# Altium schematic sheet OMODRI_EtherCAT.SchDoc
size A3; Date: Not shown in title block; ApprovedBy: Not shown in title block; CheckedBy: Not shown in title block; Author: Not shown in title block; CompanyName: Not shown in title block; Engineer: Not shown in title block; Organization: Not shown in title block; Address1: Not shown in title block; Address2: Not shown in title block; Address3: Not shown in title block; Address4: Not shown in title block; DocumentNumber: 8; Revision: Use project parameter SCH_Rev; SheetNumber: 8; SheetTotal: 11; PageSetup: Record=PageOptions|CenterHorizontal=True|CenterVertical=True|PrintScale=1.00|XCorrection=1.00|YCorrection=1.00|PrintKind=0|BorderSize=5000000|LeftOffset=0|BottomOffset=0|Orientation=2|PaperLength=1000|PaperWidth=1000|Scale=100|PaperSource=15|PrintQuality=600|MediaType=1|DitherType=10|PaperKind=Letter|PrintScaleMode=1; CurrentTime: Not shown in title block; CurrentDate: Not shown in title block; Time: Not shown in title block; DocumentFullPathAndName: Not shown in title block; DocumentName: Not shown in title block; ModifiedDate: Not shown in title block; ImagePath: Not shown in title block
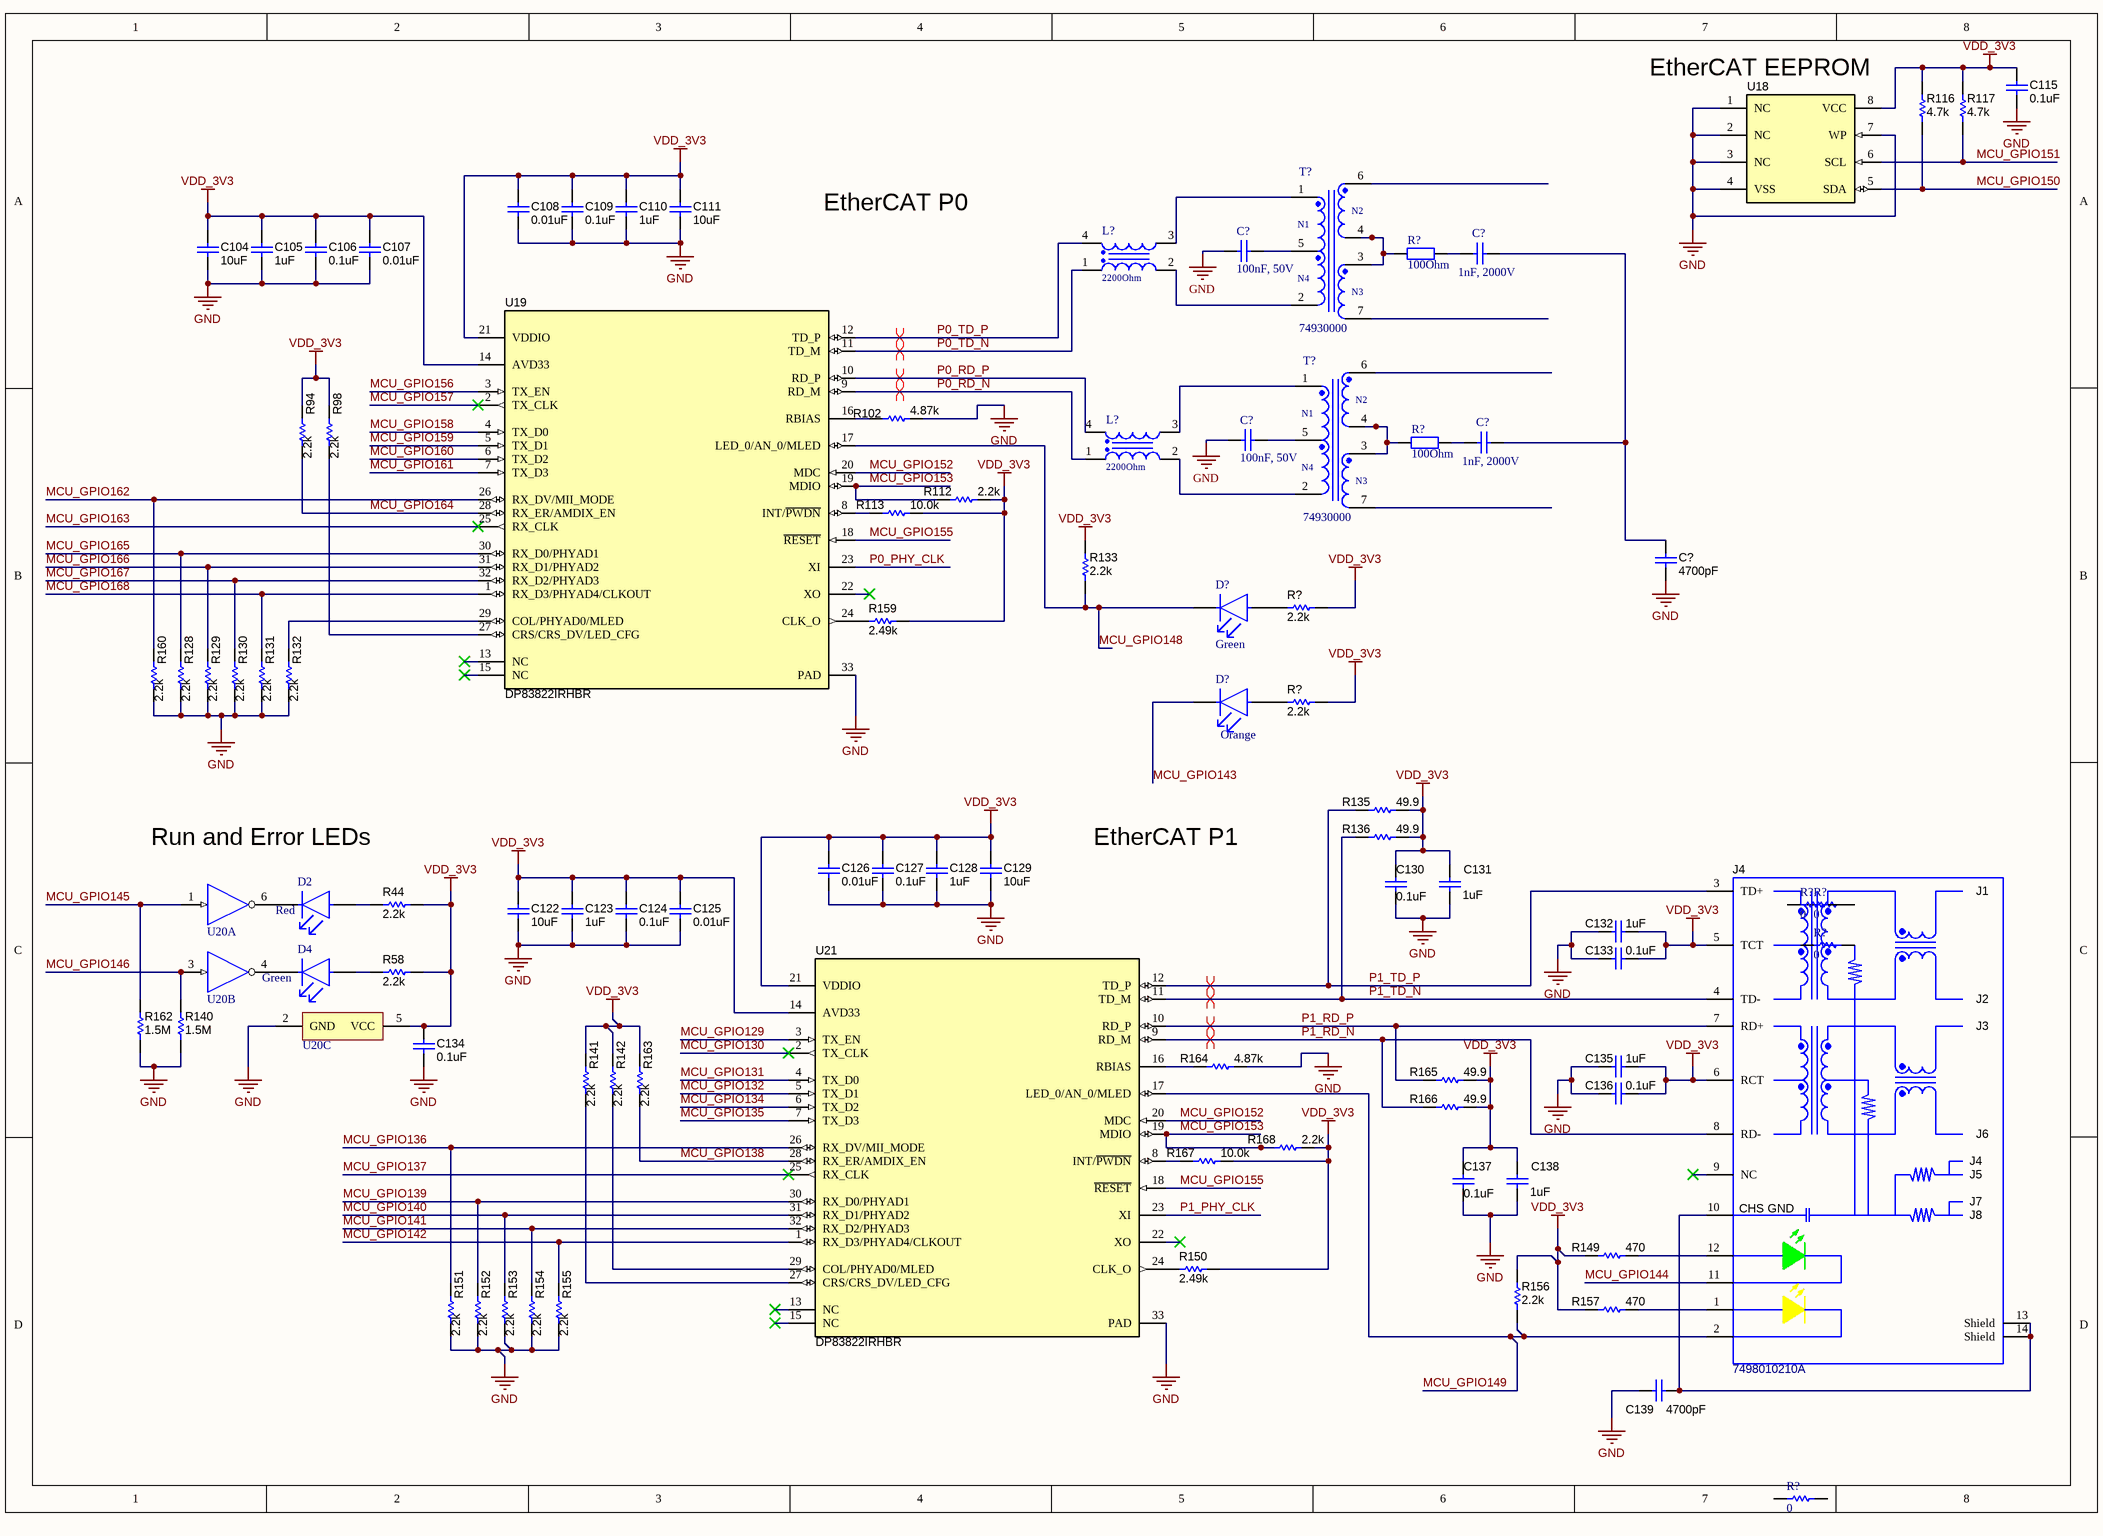
[diagram p0: OMODRI_EtherCAT.SchDoc]

## Parts
(Parts that share a designator on the sheet are numbered #1, #2 ... from top to bottom, then left to right.)
C104  ValueDisplayed: 10uF  [0402]  (hidden comment: CL05A106MQ5NUNC)
C105  ValueDisplayed: 1uF  [0402]  (hidden comment: EMK105BJ105KVHF)
C106  ValueDisplayed: 0.1uF  [0402]  (hidden comment: LMK105BJ104KV-F)
C107  ValueDisplayed: 0.01uF  [0402]  (hidden comment: 885012205031)
C108  ValueDisplayed: 0.01uF  [0402]  (hidden comment: 885012205031)
C109  ValueDisplayed: 0.1uF  [0402]  (hidden comment: LMK105BJ104KV-F)
C110  ValueDisplayed: 1uF  [0402]  (hidden comment: EMK105BJ105KVHF)
C111  ValueDisplayed: 10uF  [0402]  (hidden comment: CL05A106MQ5NUNC)
C115  ValueDisplayed: 0.1uF  [0402]  (hidden comment: CL05B104KP5NNNC)
C122  ValueDisplayed: 10uF  [0402]  (hidden comment: CL05A106MQ5NUNC)
C123  ValueDisplayed: 1uF  [0402]  (hidden comment: EMK105BJ105KVHF)
C124  ValueDisplayed: 0.1uF  [0402]  (hidden comment: LMK105BJ104KV-F)
C125  ValueDisplayed: 0.01uF  [0402]  (hidden comment: 885012205031)
C126  ValueDisplayed: 0.01uF  [0402]  (hidden comment: 885012205031)
C127  ValueDisplayed: 0.1uF  [0402]  (hidden comment: LMK105BJ104KV-F)
C128  ValueDisplayed: 1uF  [0402]  (hidden comment: EMK105BJ105KVHF)
C129  ValueDisplayed: 10uF  [0402]  (hidden comment: CL05A106MQ5NUNC)
C130  ValueDisplayed: 0.1uF  [0402]  (hidden comment: LMK105BJ104KV-F)
C131  ValueDisplayed: 1uF  [0402]  (hidden comment: EMK105BJ105KVHF)
C132  ValueDisplayed: 1uF  [0402]  (hidden comment: EMK105BJ105KVHF)
C133  ValueDisplayed: 0.1uF  [0402]  (hidden comment: LMK105BJ104KV-F)
C134  ValueDisplayed: 0.1uF  [0402]  (hidden comment: CL05B104KP5NNNC)
C135  ValueDisplayed: 1uF  [0402]  (hidden comment: EMK105BJ105KVHF)
C136  ValueDisplayed: 0.1uF  [0402]  (hidden comment: LMK105BJ104KV-F)
C137  ValueDisplayed: 0.1uF  [0402]  (hidden comment: LMK105BJ104KV-F)
C138  ValueDisplayed: 1uF  [0402]  (hidden comment: EMK105BJ105KVHF)
C139  ValueDisplayed: 4700pF  [1206]  (hidden comment: 12061C472KAT2A)
C?#1  100nF, 50V  [WCAP-CSGP_0402]
C?#2  1nF, 2000V  [WCAP-CSMH_1206_H=1.6mm]
C?#3  100nF, 50V  [WCAP-CSGP_0402]
C?#4  1nF, 2000V  [WCAP-CSMH_1206_H=1.6mm]
C?#5  ValueDisplayed: 4700pF  [1206]  (hidden comment: 12061C472KAT2A)
D2  Colour: Red  [FP-SML-P1-MFG]  (hidden comment: SML-P11UTT86R)
D4  Illumination Color: Green  [ROHM-SML-P11MT_V]  (hidden comment: SML-P11MTT86R)
D?#1  Illumination Color: Green  [ROHM-SML-P11MT_V]  (hidden comment: SML-P11MTT86R)
D?#2  Color: Orange  [ROHM-SML-P11MT_V]  (hidden comment: SML-P11DTT86R)
J4  7498010210A  [Wurth_7498010210A]
L?#1  2200Ohm  [WE-CNSW_1206]
L?#2  2200Ohm  [WE-CNSW_1206]
R44  ValueDisplayed: 2.2k  [0402]  (hidden comment: CRCW04022K20JNED)
R58  ValueDisplayed: 2.2k  [0402]  (hidden comment: CRCW04022K20JNED)
R94  ValueDisplayed: 2.2k  [0201]  (hidden comment: CRCW02012K20JNED)
R98  ValueDisplayed: 2.2k  [0201]  (hidden comment: CRCW02012K20JNED)
R102  ValueDisplayed: 4.87k  [0402]  (hidden comment: CRCW04024K87FKED)
R112  ValueDisplayed: 2.2k  [0402]  (hidden comment: CRCW04022K20JNED)
R113  ValueDisplayed: 10.0k  [0402]  (hidden comment: RC0402FR-0710KL)
R116  ValueDisplayed: 4.7k  [0402]  (hidden comment: CRCW04024K70JNED)
R117  ValueDisplayed: 4.7k  [0402]  (hidden comment: CRCW04024K70JNED)
R128  ValueDisplayed: 2.2k  [0201]  (hidden comment: CRCW02012K20JNED)
R129  ValueDisplayed: 2.2k  [0201]  (hidden comment: CRCW02012K20JNED)
R130  ValueDisplayed: 2.2k  [0201]  (hidden comment: CRCW02012K20JNED)
R131  ValueDisplayed: 2.2k  [0201]  (hidden comment: CRCW02012K20JNED)
R132  ValueDisplayed: 2.2k  [0201]  (hidden comment: CRCW02012K20JNED)
R133  ValueDisplayed: 2.2k  [0402]  (hidden comment: CRCW04022K20JNED)
R135  ValueDisplayed: 49.9  [0402]  (hidden comment: RC0402FR-0749R9L)
R136  ValueDisplayed: 49.9  [0402]  (hidden comment: RC0402FR-0749R9L)
R140  ValueDisplayed: 1.5M  [0402]  (hidden comment: CRCW04021M50JNED)
R141  ValueDisplayed: 2.2k  [0201]  (hidden comment: CRCW02012K20JNED)
R142  ValueDisplayed: 2.2k  [0201]  (hidden comment: CRCW02012K20JNED)
R149  ValueDisplayed: 470  [0603]  (hidden comment: CRCW0603470RJNEA)
R150  ValueDisplayed: 2.49k  [0402]  (hidden comment: CRCW04022K49FKED)
R151  ValueDisplayed: 2.2k  [0201]  (hidden comment: CRCW02012K20JNED)
R152  ValueDisplayed: 2.2k  [0201]  (hidden comment: CRCW02012K20JNED)
R153  ValueDisplayed: 2.2k  [0201]  (hidden comment: CRCW02012K20JNED)
R154  ValueDisplayed: 2.2k  [0201]  (hidden comment: CRCW02012K20JNED)
R155  ValueDisplayed: 2.2k  [0201]  (hidden comment: CRCW02012K20JNED)
R156  ValueDisplayed: 2.2k  [0402]  (hidden comment: CRCW04022K20JNED)
R157  ValueDisplayed: 470  [0603]  (hidden comment: CRCW0603470RJNEA)
R159  ValueDisplayed: 2.49k  [0402]  (hidden comment: CRCW04022K49FKED)
R160  ValueDisplayed: 2.2k  [0201]  (hidden comment: CRCW02012K20JNED)
R162  ValueDisplayed: 1.5M  [0402]  (hidden comment: CRCW04021M50JNED)
R163  ValueDisplayed: 2.2k  [0201]  (hidden comment: CRCW02012K20JNED)
R164  ValueDisplayed: 4.87k  [0402]  (hidden comment: CRCW04024K87FKED)
R165  ValueDisplayed: 49.9  [0402]  (hidden comment: RC0402FR-0749R9L)
R166  ValueDisplayed: 49.9  [0402]  (hidden comment: RC0402FR-0749R9L)
R167  ValueDisplayed: 10.0k  [0402]  (hidden comment: RC0402FR-0710KL)
R168  ValueDisplayed: 2.2k  [0402]  (hidden comment: CRCW04022K20JNED)
R?#1  100Ohm  [WRIS-KWKB_0612_H=0.55mm]
R?#2  100Ohm  [WRIS-KWKB_0612_H=0.55mm]
R?#3  ValueDisplayed: 2.2k  [0402]  (hidden comment: CRCW04022K20JNED)
R?#4  ValueDisplayed: 2.2k  [0402]  (hidden comment: CRCW04022K20JNED)
R?#5  value 0  [RESC1608X55X25ML10T15]  (hidden comment: Resistor 0R +/- 5% 0603 100 mW)
R?#6  value 0  [RESC1608X55X25ML10T15]  (hidden comment: Resistor 0R +/- 5% 0603 100 mW)
R?#7  value 0  [RESC1608X55X25ML10T15]  (hidden comment: Resistor 0R +/- 5% 0603 100 mW)
R?#8  value 0  [RESC1608X55X25ML10T15]  (hidden comment: Resistor 0R +/- 5% 0603 100 mW)
T?#1  74930000  [74930000]
T?#2  74930000  [74930000]
U18  CAT24C16WI-GT3  [SOIC-8]  (value not drawn)
U19  DP83822IRHBR  [RHB0032B]
U20  SN74LVC2G06DBVR  [DBV0006A_N]  (value not drawn)  (parts A,B,C of 3)
U21  DP83822IRHBR  [RHB0032B]

## Nets
GND: C104.2 C105.2 C106.2 C107.2 C108.2 C109.2 C110.2 C111.2 C115.2 C122.2 C123.2 C124.2 C125.2 C126.2 C127.2 C128.2 C129.2 C130.2 C131.2 C132.1 C133.1 C134.2 C135.1 C136.1 C137.2 C138.2 C139.1 C?#1.1 C?#3.1 C?#5.1 R102.2 R128.1 R129.1 R130.1 R131.1 R132.1 R140.2 R151.1 R152.1 R153.1 R154.1 R155.1 R160.1 R162.2 R164.2 U18.1(NC) U18.2(NC) U18.3(NC) U18.4(VSS) U18.7(WP) U19.33(PAD) U20.2(GND) U21.33(PAD)
VDD_3V3: C104.1 C105.1 C106.1 C107.1 C108.1 C109.1 C110.1 C111.1 C115.1 C122.1 C123.1 C124.1 C125.1 C126.1 C127.1 C128.1 C129.1 C130.1 C131.1 C132.2 C133.2 C134.1 C135.2 C136.2 C137.1 C138.1 J4.5(TCT) J4.6(RCT) R44.1 R58.1 R94.2 R98.2 R112.1 R113.2 R116.2 R117.2 R133.2 R135.2 R136.2 R141.2 R142.2 R149.1 R150.1 R156.2 R157.1 R159.1 R163.2 R165.2 R166.2 R167.2 R168.1 R?#3.1 R?#4.1 U18.8(VCC) U19.14(AVD33) U19.21(VDDIO) U20.5(VCC) U21.14(AVD33) U21.21(VDDIO)
MCU_GPIO129: U21.3(TX_EN)
MCU_GPIO130: U21.2(TX_CLK)
MCU_GPIO131: U21.4(TX_D0)
MCU_GPIO132: U21.5(TX_D1)
MCU_GPIO134: U21.6(TX_D2)
MCU_GPIO135: U21.7(TX_D3)
MCU_GPIO136: R151.2 U21.26(RX_DV/MII_MODE)
MCU_GPIO137: U21.25(RX_CLK)
MCU_GPIO138: R163.1 U21.28(RX_ER/AMDIX_EN)
MCU_GPIO139: R152.2 U21.30(RX_D0/PHYAD1)
MCU_GPIO140: R153.2 U21.31(RX_D1/PHYAD2)
MCU_GPIO141: R154.2 U21.32(RX_D2/PHYAD3)
MCU_GPIO142: R155.2 U21.1(RX_D3/PHYAD4/CLKOUT)
MCU_GPIO143: D?#2.1(C)
MCU_GPIO144: J4.11(LEFT_LED_CATHODE)
MCU_GPIO145: R162.1 U20.1(1A)
MCU_GPIO146: R140.1 U20.3(2A)
MCU_GPIO148: D?#1.1(C) R133.1 U19.17(LED_0/AN_0/MLED)
MCU_GPIO149: J4.2(RIGHT_LED_CATHODE) R156.1 U21.17(LED_0/AN_0/MLED)
MCU_GPIO150: R116.1 U18.5(SDA)
MCU_GPIO151: R117.1 U18.6(SCL)
MCU_GPIO152: U19.20(MDC) U21.20(MDC)
MCU_GPIO153: R112.2 R168.2 U19.19(MDIO) U21.19(MDIO)
MCU_GPIO155: U19.18(~{RESET}) U21.18(~{RESET})
MCU_GPIO156: U19.3(TX_EN)
MCU_GPIO157: U19.2(TX_CLK)
MCU_GPIO158: U19.4(TX_D0)
MCU_GPIO159: U19.5(TX_D1)
MCU_GPIO160: U19.6(TX_D2)
MCU_GPIO161: U19.7(TX_D3)
MCU_GPIO162: R160.2 U19.26(RX_DV/MII_MODE)
MCU_GPIO163: U19.25(RX_CLK)
MCU_GPIO164: R94.1 U19.28(RX_ER/AMDIX_EN)
MCU_GPIO165: R128.2 U19.30(RX_D0/PHYAD1)
MCU_GPIO166: R129.2 U19.31(RX_D1/PHYAD2)
MCU_GPIO167: R130.2 U19.32(RX_D2/PHYAD3)
MCU_GPIO168: R131.2 U19.1(RX_D3/PHYAD4/CLKOUT)
P0_PHY_CLK: U19.23(XI)
P0_RD_N: L?#2.1 U19.9(RD_M)
P0_RD_P: L?#2.4 U19.10(RD_P)
P0_TD_N: L?#1.1 U19.11(TD_M)
P0_TD_P: L?#1.4 U19.12(TD_P)
P1_PHY_CLK: U21.23(XI)
P1_RD_N: J4.8(RD-) R166.1 U21.9(RD_M)
P1_RD_P: J4.7(RD+) R165.1 U21.10(RD_P)
P1_TD_N: J4.4(TD-) R136.1 U21.11(TD_M)
P1_TD_P: J4.3(TD+) R135.1 U21.12(TD_P)
NetC139_2: C139.2 J4.10(CHS_GND) J4.13(Shield) J4.14(Shield)
NetC?#1_2: C?#1.2 T?#1.5
NetC?#2_1: C?#2.1 C?#4.1 C?#5.2
NetC?#2_2: C?#2.2 R?#1.1
NetC?#3_2: C?#3.2 T?#2.5
NetC?#4_2: C?#4.2 R?#2.1
NetD2_1: D2.1(C) U20.6(1Y)
NetD2_2: D2.2(A) R44.2
NetD4_1: D4.1(C) U20.4(2Y)
NetD4_2: D4.2(A) R58.2
NetD?#1_2: D?#1.2(A) R?#3.2
NetD?#2_2: D?#2.2(A) R?#4.2
NetJ4_1: J4.1(RIGHT_LED_ANODE) R157.2
NetJ4_12: J4.12(LEFT_LED_ANODE) R149.2
NetL?#1_2: L?#1.2 T?#1.2
NetL?#1_3: L?#1.3 T?#1.1
NetL?#2_2: L?#2.2 T?#2.2
NetL?#2_3: L?#2.3 T?#2.1
NetR98_1: R98.1 U19.27(CRS/CRS_DV/LED_CFG)
NetR102_1: R102.1 U19.16(RBIAS)
NetR113_1: R113.1 U19.8(INT/~{PWDN})
NetR132_2: R132.2 U19.29(COL/PHYAD0/MLED)
NetR141_1: R141.1 U21.27(CRS/CRS_DV/LED_CFG)
NetR142_1: R142.1 U21.29(COL/PHYAD0/MLED)
NetR150_2: R150.2 U21.24(CLK_O)
NetR159_2: R159.2 U19.24(CLK_O)
NetR164_1: R164.1 U21.16(RBIAS)
NetR167_1: R167.1 U21.8(INT/~{PWDN})
NetR?#1_2: R?#1.2 T?#1.3 T?#1.4
NetR?#2_2: R?#2.2 T?#2.3 T?#2.4

Not connected (* = marked no-connect by the designer): J4 9(NC)*; R?#5 1 2; R?#6 1 2; R?#7 1 2; R?#8 1 2; T?#1 6 7; T?#2 6 7; U19 13(NC)* 15(NC)* 22(XO)*; U21 13(NC)* 15(NC)* 22(XO)*

## Layout directives
differential pair: P0_RD_N, P0_RD_P, P0_TD_N, P0_TD_P, P1_RD_N, P1_RD_P, P1_TD_N, P1_TD_P

## Notes on the sheet
- (near U18) EtherCAT EEPROM
- EtherCAT P0
- Run and Error LEDs
- EtherCAT P1
- Title
- Size:
- Date:
- File:
- A2
- Number:
- Time:
- Revision:
- Sheet
- of
- (in symbol 74930000) N2; N1; N4; N3
- (in symbol CMP-0086350-1) J1; J2; J3; J6; J5; J7; J8

## Library data of the parts
C104 C111 C122 C129 = CMP-0006340-2: CAP, CERM, 10 uF, 6.3 V, +/- 20%, X5R, 0402; Manufacturer: Samsung Electro-Mechanics; TaMin_C: -55°C; Polarized: N; SizeAreaWB_mm2: 3; Value1: Unknown; U/M: EA; Value: 10uF; TaMax_C: 85°C; SizeZ_mm: 0.6; SizeX_mm: 1; SizeY_mm: 0.5; Value2: 6.3V; Cap_F: 10µF; AEC Category: Q200; Publisher: Texas Instruments; TempCo: X5R; Published: 2008-06-19; RoHS: Y; MountType: SMT; PackageReference: 0402; Tolerance_%: 20%; Cap_Case: 0402; SizeArea_mm2: 0.5; CompType: Capacitor; LatestRevisionDate: 2017-03-09; PartNumber: CL05A106MQ5NUNC; AEC Qualified: ?; ComponentLink1Description: Datasheet link; Technology: Ceramic; ComponentLink1URL: http://www.samsungsem.com/servlet/DownloadServlet?dir=partnumber&num=&fileName=CL05A106MQ5NUNC.pdf
C105 C110 C123 C128 C131 C132 C135 C138 = CMP-0006347-2: CAP, CERM, 1 uF, 16 V, +/- 10%, X5R, 0402; Manufacturer: Taiyo Yuden; TaMin_C: -55°C; Polarized: N; SizeAreaWB_mm2: 3; Value1: Unknown; U/M: EA; Value: 1uF; TaMax_C: 85°C; SizeZ_mm: 0.6; SizeX_mm: 1; SizeY_mm: 0.5; Value2: 16V; Cap_F: 1µF; AEC Category: Q200; Supplier Part Number 2: 68X1293; Publisher: Texas Instruments; Supplier 2: Newark; TempCo: X5R; Published: 2008-06-19; RoHS: Y; MountType: SMT; Supplier 1: Digi-Key; PackageReference: 0402; Tolerance_%: 10%; Cap_Case: 0402; SizeArea_mm2: 0.5; CompType: Capacitor; LatestRevisionDate: 2017-03-09; PartNumber: EMK105BJ105KVHF; AEC Qualified: ?; ComponentLink1Description: Datasheet link; Supplier Part Number 1: 587-3709-2-ND; Technology: Ceramic; ComponentLink1URL: http://www.yuden.co.jp/ut/product/category/capacitor/EMK105BJ105KVHF_SS.pdf
C106 C109 C124 C127 C130 C133 C136 C137 = CMP-0064930-2: CAP, CERM, 0.1 uF, 10 V,+/- 10%, X5R, 0402; Manufacturer: Taiyo Yuden; TaMin_C: -55°C; Polarized: N; SizeAreaWB_mm2: 3; Value1: Unknown; U/M: EA; Value: 0.1uF; TaMax_C: 85°C; SizeZ_mm: 0.6; SizeX_mm: 1; SizeY_mm: 0.5; Value2: 10V; Cap_F: 100nF; AEC Category: Q200; Supplier Part Number 2: 86H5618; Publisher: Texas Instruments; Supplier 2: Newark; Supplier Part Number 3: 963-LMK105BJ104KV-F; TempCo: X5R; Supplier 3: Mouser; Published: 2008-06-19; RoHS: Y; MountType: SMT; Supplier 1: Digi-Key; PackageReference: 0402; Tolerance_%: 10%; Cap_Case: 0402; SizeArea_mm2: 0.5; CompType: Capacitor; LatestRevisionDate: 2017-06-05; PartNumber: LMK105BJ104KV-F; AEC Qualified: N; ComponentLink1Description: Datasheet link; AEC Grade: N/A; Supplier Part Number 1: 587-1227-1-ND; Technology: Ceramic; ComponentLink1URL: http://ds.yuden.co.jp/TYCOMPAS/ut/detail.do?productNo=LMK105BJ104KV-F&fileName=LMK105BJ104KV-F_SS&mode=specSheetDownload; VDC_V: 10V
C107 C108 C125 C126 = CMP-0006227-2: CAP, CERM, 0.01 uF, 16 V, +/- 10%, X7R, 0402; Manufacturer: Wurth Elektronik; TaMin_C: -55°C; Polarized: N; SizeAreaWB_mm2: 3; Value1: Unknown; U/M: EA; Value: 0.01uF; TaMax_C: 125°C; SizeZ_mm: 0.6; SizeX_mm: 1; SizeY_mm: 0.5; Value2: 16V; Cap_F: 10nF; AEC Category: Q200; Publisher: Texas Instruments; TempCo: X7R; Published: 2008-06-19; RoHS: Y; MountType: SMT; Supplier 1: Mouser; PackageReference: 0402; Tolerance_%: 10%; Cap_Case: 0402; SizeArea_mm2: 0.5; CompType: Capacitor; LatestRevisionDate: 2017-03-09; PartNumber: 885012205031; AEC Qualified: N; ComponentLink1Description: Datasheet link; AEC Grade: N/A; Supplier Part Number 1: 710-885012205031; Technology: Ceramic; ComponentLink1URL: http://katalog.we-online.de/pbs/datasheet/885012205031.pdf
C115 C134 = CMP-0006343-2: CAP, CERM, 0.1 uF, 10 V, +/- 10%, X7R, 0402; Manufacturer: Samsung Electro-Mechanics; Polarized: N; Value: 0.1uF; U/M: EA; Cap_F: 100nF; Value1: Unknown; VDC_V: 10V; TaMin_C: -55°C; TaMax_C: 125°C; AEC Category: Q200; SizeArea_mm2: 0.5; SizeAreaWB_mm2: 3; SizeX_mm: 1; SizeZ_mm: 0.6; CompType: Capacitor; PartNumber: CL05B104KP5NNNC; PackageReference: 0402; RoHS: Y; Tolerance_%: 10%; Value2: 10V; MountType: SMT; Technology: Ceramic; TempCo: X7R; Cap_Case: 0402; Published: 2008-06-19; Publisher: Texas Instruments; LatestRevisionDate: 2017-03-09; ComponentLink1Description: Datasheet link; ComponentLink1URL: http://www.samsungsem.com/kr/front/downloadcms.do?path=/kr/support/product-search/mlcc/__icsFiles/afieldfile/2014/11/05&fileName=S_CL05B104KP5NNNC.pdf; AEC Qualified: N; AEC Grade: N/A; SizeY_mm: 0.5
C139 C?#5 = CMP-0008501-2: CAP, CERM, 4700 pF, 100 V, +/- 10%, X7R, 1206; Manufacturer: AVX; TaMin_C: -55°C; ESR_ohm: 1.78d; Polarized: N; SizeAreaWB_mm2: 10.92; Value1: 0.178 ohm; U/M: EA; Value: 4700pF; TaMax_C: 125°C; SizeZ_mm: 1.35; SizeX_mm: 3.2; SizeY_mm: 1.6; Value2: 100V; SizeArea_mm2: 5.12; Cap_F: 4.7nF; AEC Category: Q200; Supplier Part Number 2: 96M1479; Publisher: Texas Instruments; Supplier 2: Newark; Supplier Part Number 3: 581-12061C472K; TempCo: X7R; Supplier 3: Mouser; Published: 2008-06-19; RoHS: Y; MountType: SMT; Supplier 1: Digi-Key; PackageReference: 1206; Tolerance_%: 10%; Cap_Case: 1206; CompType: Capacitor; LatestRevisionDate: 2017-03-09; PartNumber: 12061C472KAT2A; AEC Qualified: N; ComponentLink1Description: Datasheet link; AEC Grade: N/A; Supplier Part Number 1: 478-1521-1-ND; Technology: Ceramic; ComponentLink1URL: http://datasheets.avx.com/X7RDielectric.pdf
C?#1 C?#3 = 885012205086: WCAP-CSGP General Purpose Ceramic Capacitors, size 0402, 100nF, +/-10%, 50VDC; Isolation Resistance: >=0.5GOhm; Ceramic Type: X7R; Technical Reference: X7R0402104K050DFCT10000; ComponentLink1Description: Manufacturer; ComponentLink1URL: http://www.we-online.de; ComponentLink2Description: Datasheet; ComponentLink2URL: https://katalog.we-online.com/pbs/datasheet/885012205086.pdf; Operating Temperature: -55 to +125degC; Packaging: Tape and Reel; Part Number: 885012205086; Publisher: Wurth Elektronik; Rated Voltage: 50VDC; Published Date: August 2019; Capacitance Tolerance: +/-10%; Dissipation Factor: =<10%; Height: 0.5mm +/-0.20mm; Mounting Technology: SMT; Size: 0402; Capacitance: 100nF
C?#2 C?#4 = 885342208024: WCAP-CSMH Ceramic Capacitors, size 1206, 1nF, 2000VDC; Ceramic Type: X7R Class II; Dissipation Factor: 2.5%; Insulation Resistance: 10GOhm; Technical Reference: X7R1206102KB00DFCT10000; ComponentLink1Description: Manufacturer; ComponentLink1URL: http://www.we-online.de; ComponentLink2Description: Datasheet; ComponentLink2URL: https://katalog.we-online.com/pbs/datasheet/885342208024.pdf; Packaging: Tape and Reel; Part Number: 885342208024; Published Date: August 2019; Rated Voltage: 2000VDC; Size: 1206; Mounting Technology: SMD; Publisher: Wurth Elektronik; Capacitance: 1nF; Operating Temperature: -55 to +125degC
D2 = SML-P11UTT86R: LED, PICOLED, Red, SMD, 1 mA, 1.8 V, 621 nm; Manufacturer Part Number: SML-P11VTT86R; Manufacturer: Rohm; Led Orientation: Top View; Power Dissipation: 50mW; Wavelength: 626nm; Forward Voltage: 1.8V; Forward Current: 1mA; Luminous Intensity: 4mcd; Reverse Voltage: 5V; Lens Color: Colorless; Lens Style: Square,Diffused,Colorless; Number of LEDs: 1; Lens Transparency: Clear; Dominant Wavelength: 621nm; ComponentLink2URL: https://www.rohm.com/datasheet/SML-P11VT(R)/sml-p11-e; Temperature: -40°C to +85°C; Device Class L2: LEDs; Package: SML-P1; Category: Diode; Automotive: No; RoHS: TRUE; Lead Free: Yes; Digikey Description: LED RED CLEAR 1006 SMD; Device Class L3: unset; ComponentLink2Description: Datasheet; Octopart: https://octopart.com/sml-p11vtt86r-rohm-34112314; Device Class L1: Optoelectronics; Temperature Range High: +85°C; Temperature Range Low: -40°C; Mouser Description: SML-P11 Series Red 0402 Clear 4 mcd 1.8 V Surface Mount PICOLED? LED; Height: 0.25mm; Supplier 1: Digi-Key; Stock 1: 132; Pricing 1: 1=0,39000, 10=0,27600, 100=0,16100, 500=0,11040, 1000=0,09200, 2500=0,08280 (USD); Mount: Surface Mount; Case/Package: 0402; Number of Pins: 2; Color: Red; Packaging: Cut Tape; Test Current: 1mA; Length: 1mm; Width: 0.6mm; REACH SVHC: Unknown; ComponentLink1URL: https://datasheet.ciiva.com/48679/sml-p11-p-eco-48679068.pdf?src-supplier=Avnet; ComponentLink1Description: https://datasheet.ciiva.com/48679/sml-p11-p-eco-48679068.pdf?src-supplier=Avnet; Supplier Part Number 1: SML-P11UTT86RCT-ND
D4 D?#1 = SML-P11MTT86R: LED Uni-Color Yellow Green 2-Pin Chip 0402(1006Metric) T/R; Manufacturer: Rohm; Lens Color: Colorless,Clear; Lens Style: Diffused,Colorless,Rectangular,Square,Clear; Number of LEDs: 1; Luminous Intensity: 2.1mcd; Forward Voltage: 1.9V; Wavelength: 569nm; Forward Current: 20mA; Test Current: 1mA; Lens Transparency: Clear; Viewing Angle: 150°; Power Rating: 54mW; Color: Green,Yellow; Supplier 1: Digi-Key; Manufacturer Part Number: SML-P11MTT86; RoHS: Yes; Category: LEDs; Stock 1: 6550; Pricing 1: 1=0,39000, 10=0,27200, 100=0,15890, 500=0,10896, 1000=0,09080, 2500=0,08172, 5000=0,07718 (USD); Mount: Surface Mount; Case/Package: 0402; Number of Pins: 2; Case Code (Imperial): 0402; Case Code (Metric): 1005; Min Operating Temperature: -40°C; Max Operating Temperature: 85°C; Packaging: Tape and Reel; Dominant Wavelength: 569nm; Package Quantity: 1; Length: 1mm; Height: 0.25mm; Width: 0.6mm; Radiation Hardening: No; REACH SVHC: No SVHC; Lead Free: Lead Free; ComponentLink1URL: https://datasheet.ciiva.com/5685/1738942-5685465.pdf?src-supplier=Farnell; ComponentLink1Description: https://datasheet.ciiva.com/5685/1738942-5685465.pdf?src-supplier=Farnell; ComponentLink2URL: https://datasheet.ciiva.com/11773/0900766b80df3ad7-11773737.pdf?src-supplier=RSComponents; ComponentLink2Description: https://datasheet.ciiva.com/11773/0900766b80df3ad7-11773737.pdf?src-supplier=RSComponents; ComponentLink3URL: https://datasheet.ciiva.com/16201/sml-p11mtt86-16201197.pdf?src-supplier=Future+Electronics; ComponentLink3Description: https://datasheet.ciiva.com/16201/sml-p11mtt86-16201197.pdf?src-supplier=Future+Electronics; ComponentLink4URL: https://datasheet.ciiva.com/2114/sml-p11-p-eco-2114983.pdf?src-supplier=Digi-Key; ComponentLink4Description: https://datasheet.ciiva.com/2114/sml-p11-p-eco-2114983.pdf?src-supplier=Digi-Key; ComponentLink5URL: https://datasheet.ciiva.com/2114/sml-p11-p-eco-2114984.pdf?src-supplier=Digi-Key; ComponentLink5Description: https://datasheet.ciiva.com/2114/sml-p11-p-eco-2114984.pdf?src-supplier=Digi-Key; ComponentLink6URL: https://datasheet.ciiva.com/2114/sml-p11-p-eco-2114985.pdf?src-supplier=Digi-Key; ComponentLink6Description: https://datasheet.ciiva.com/2114/sml-p11-p-eco-2114985.pdf?src-supplier=Digi-Key; ComponentLink7URL: https://datasheet.ciiva.com/4689/sml-p1-471200-4689502.pdf?src-supplier=Mouser; ComponentLink7Description: https://datasheet.ciiva.com/4689/sml-p1-471200-4689502.pdf?src-supplier=Mouser; ComponentLink8URL: https://datasheet.ciiva.com/29281/157928-da-01-en-led-0402-gelb-gruen-sml-p11mt-t86-29281338.pdf?src-supplier=Conrad; ComponentLink8Description: https://datasheet.ciiva.com/29281/157928-da-01-en-led-0402-gelb-gruen-sml-p11mt-t86-29281338.pdf?src-supplier=Conrad; Supplier Part Number 1: 511-1652-1-ND
D?#2 = SML-P11DTT86R: LED ORANGE CLEAR 1006 SMD; Manufacturer: Rohm; Lens Color: Colorless; Luminous Intensity: 7.3mcd; Test Current: 1mA; Dominant Wavelength: 605nm; Forward Voltage: 1.9V; Lens Style: Square,Diffused,Colorless; Number of LEDs: 1; Supplier 1: Digi-Key; Manufacturer Part Number: SML-P11DTT86R; RoHS: Yes; Category: LEDs; Stock 1: 2306; Pricing 1: 1=0,48000, 10=0,34300, 100=0,22400, 500=0,16100, 1000=0,12600, 2500=0,11550 (USD); Mount: Surface Mount; Case/Package: SMD/SMT; Number of Pins: 2; Lens Transparency: Clear; Forward Current: 1mA; Wavelength: 605nm; Packaging: Tape and Reel; Length: 1mm; Height: 0.25mm; Width: 0.6mm; REACH SVHC: Unknown; Lead Free: Lead Free; ComponentLink1URL: https://datasheet.ciiva.com/48679/sml-p11-p-eco-48679066.pdf?src-supplier=Avnet; ComponentLink1Description: https://datasheet.ciiva.com/48679/sml-p11-p-eco-48679066.pdf?src-supplier=Avnet; Supplier Part Number 1: SML-P11DTT86RCT-ND
J4 = CMP-0086350-1: Connector, RJ45, 1x1, Gold, R/A, SMT; Manufacturer: Wurth Elektronik; Row_Count: 1; Gender: Female; ComponentLink1URL: https://sps16.itg.ti.com/sites/KMS/crossdivteams/altium/docs/ComponentDatasheets/7498010210A.pdf; ContactFinish: Gold; MountType: SMT; PinCount: 12; RoHS: Y; PackageReference: Connector, RJ45, 1x1, Gold, R/A, SMT; ComponentLink1Description: Datasheet URL; Orientation: R/A; CompType: RJ45; PartNumber: 7498010210A
L?#1 L?#2 = 744232222: WE-CNSW SMT Common Mode Line Filter, size 1206, 2200Ohm, 0.2A, 50V; Manufacturer: Wurth Elektronik; DC Resistance max.: 1.2Ohm; Impedance Test Condition: 100MHz; Insulation Test Voltage: 125VAC; Winding Style: bifiliar; ComponentLink1Description: Manufacturer; ComponentLink1URL: http://www.we-online.de; ComponentLink2Description: Datasheet; ComponentLink2URL: https://www.we-online.com/catalog/datasheet/744232222.pdf; Operating Temperature: -40 to +125degC; Packaging: Tape and Reel; Published Date: April 2020; Rated Current: 0.2A; Size: 1206; Impedance: 2200Ohm; Manufacturer Part Number: 744232222; Rated Voltage: 50V; Mounting Technology: SMT
R44 R58 R112 R133 R156 R168 R?#3 R?#4 = CMP-0026890-5: RES, 2.2 k, 5%, 0.063 W, AEC-Q200 Grade 0, 0402; Manufacturer: Vishay-Dale; Power_W: 63mW; TempCo: 200 ppm/C; Value_Code: 2k20; Value: 2.2k; EIA_Code: E24; SizeX_mm: 1; SizeY_mm: 0.5; SizeZ_mm: 0.6; Value2: 0.063W; AEC Qualified: Y; VDC_V: 50V; AEC Category: Q200; AEC Grade: 0; Supplier Part Number 2: 59M6710; Supplier 2: Newark; Supplier Part Number 3: 71-CRCW0402J-2.2K-E3; Supplier 3: Mouser; RoHS: E; Value1: 5%; MountType: SMT; Supplier 1: Digi-Key; PackageReference: 0402; Tolerance_%: 5%; Res_ohm: 2.2k; SizeArea_mm2: 0.5; CompType: Resistor; PartNumber: CRCW04022K20JNED; ComponentLink1Description: Datasheet link; Supplier Part Number 1: 541-2.2KJCT-ND; Technology: Thick Film; ComponentLink1URL: http://www.vishay.com/docs/20035/dcrcwe3.pdf
R94 R98 R128-R132 R141 R142 R151-R155 R160 R163 = CMP-0027010-2: RES, 2.2 k, 5%, 0.05 W, 0201; Manufacturer: Vishay-Dale; Power_W: 50mW; TempCo: 200 ppm/C; Value_Code: 2k20; Value: 2.2k; EIA_Code: E24; SizeX_mm: 0.6; SizeY_mm: 0.3; SizeZ_mm: 0.26; Value2: 0.05W; SizeArea_mm2: 0.18; AEC Qualified: N; VDC_V: 30V; AEC Category: Q200; ComponentLink1URL: http://www.vishay.com/docs/20052/crcw0201e3.pdf; Supplier Part Number 2: 48P7324; Supplier 2: Newark; Supplier Part Number 3: 71-CRCW02012K20JNED; Supplier 3: Mouser; RoHS: E; Value1: 5%; MountType: SMT; Supplier 1: Digi-Key; PackageReference: 0201; Tolerance_%: 5%; Res_ohm: 2.2k; CompType: Resistor; PartNumber: CRCW02012K20JNED; ComponentLink1Description: Datasheet link; AEC Grade: N/A; Supplier Part Number 1: 541-2.2KAGCT-ND; Technology: Thick Film
R102 R164 = CMP-0026413-2: RES, 4.87 k, 1%, 0.063 W, AEC-Q200 Grade 0, 0402; Manufacturer: Vishay-Dale; Power_W: 63mW; TempCo: 100 ppm/C; Value_Code: 4k87; Value: 4.87k; EIA_Code: E96; SizeX_mm: 1; SizeY_mm: 0.5; SizeZ_mm: 0.6; Value2: 0.063W; AEC Qualified: Y; VDC_V: 50V; AEC Category: Q200; AEC Grade: 0; ComponentLink1URL: http://www.vishay.com/docs/20035/dcrcwe3.pdf; Supplier Part Number 2: 52K7047; Supplier 2: Newark; Supplier Part Number 3: 71-CRCW0402-4.87K-E3; Supplier 3: Mouser; RoHS: E; Value1: 1%; MountType: SMT; Supplier 1: Digi-Key; PackageReference: 0402; Tolerance_%: 1%; Res_ohm: 4.87k; SizeArea_mm2: 0.5; CompType: Resistor; PartNumber: CRCW04024K87FKED; ComponentLink1Description: Datasheet link; Supplier Part Number 1: 541-4.87KLCT-ND; Technology: Thick Film
R113 R167 = CMP-0078669-1: RES, 10.0 k, 1%, 0.063 W, 0402; Manufacturer: Yageo America; Power_W: 63mW; Green_Lifecycle: Active; TempCo: 100 ppm/C; Value_Code: 10k0; Green_REACh: Passed; Value: 10.0k; EIA_Code: E96; Res_ohm: 10k; SizeX_mm: 1; SizeY_mm: 0.5; SizeZ_mm: 0.6; Value2: 0.063W; AEC Qualified: N; AEC Category: Q200; ComponentLink1URL: http://www.yageo.com/documents/recent/PYu-RC_Group_51_RoHS_L_8.pdf; Supplier Part Number 2: 98K7499; Supplier 2: Newark; Supplier Part Number 3: 603-RC0402FR-0710KL; Supplier 3: Mouser; RoHS: Y; Value1: 1%; MountType: SMT; Green_EU RoHS-2: Passed; Supplier 1: Digi-Key; Green_EU RoHS: Passed with Exemption; PackageReference: 0402; Tolerance_%: 1%; SizeArea_mm2: 0.5; CompType: Resistor; PartNumber: RC0402FR-0710KL; ComponentLink1Description: Datasheet link; AEC Grade: N/A; Supplier Part Number 1: 311-10.0KLRCT-ND; Technology: Thick Film
R116 R117 = CMP-0026938-5: RES, 4.7 k, 5%, 0.063 W, AEC-Q200 Grade 0, 0402; Manufacturer: Vishay-Dale; Power_W: 63mW; TempCo: 200 ppm/C; Value_Code: 4k70; Value: 4.7k; EIA_Code: E24; SizeX_mm: 1; SizeY_mm: 0.5; SizeZ_mm: 0.6; Value2: 0.063W; AEC Qualified: Y; VDC_V: 50V; AEC Category: Q200; AEC Grade: 0; Supplier Part Number 2: 59M6733; Supplier 2: Newark; Supplier Part Number 3: 71-CRCW0402J-4.7K-E3; Supplier 3: Mouser; RoHS: E; Value1: 5%; MountType: SMT; Supplier 1: Digi-Key; PackageReference: 0402; Tolerance_%: 5%; Res_ohm: 4.7k; SizeArea_mm2: 0.5; CompType: Resistor; PartNumber: CRCW04024K70JNED; ComponentLink1Description: Datasheet link; Supplier Part Number 1: 541-4.7KJCT-ND; Technology: Thick Film; ComponentLink1URL: http://www.vishay.com/docs/20035/dcrcwe3.pdf
R135 R136 R165 R166 = CMP-0026738-1: RES, 49.9, 1%, 0.063 W, 0402; Manufacturer: Yageo America; Power_W: 63mW; TempCo: 100 ppm/C; Value_Code: 49R9; U/M: EA; Value: 49.9; EIA_Code: E96; SizeX_mm: 1; SizeY_mm: 0.5; SizeZ_mm: 0.6; Value2: 0.063W; AEC Qualified: N; VDC_V: 50V; AEC Category: Q200; ComponentLink1URL: http://www.yageo.com/documents/recent/PYu-RC_Group_51_RoHS_L_1.pdf; Supplier Part Number 2: 67R9942; Publisher: Texas Instruments; Supplier 2: Newark; Supplier Part Number 3: 603-RC0402FR-0749R9L; Supplier 3: Mouser; Published: 2008-06-26; RoHS: Y; Value1: 1%; MountType: SMT; Supplier 1: Digi-Key; PackageReference: 0402; Tolerance_%: 1%; Res_ohm: 49.9; SizeArea_mm2: 0.5; CompType: Resistor; LatestRevisionDate: 2017-03-09; PartNumber: RC0402FR-0749R9L; ComponentLink1Description: Datasheet link; AEC Grade: N/A; Supplier Part Number 1: 311-49.9LRCT-ND; Technology: Thick Film
R140 R162 = CMP-0026863-2: RES, 1.5 M, 5%, 0.063 W, AEC-Q200 Grade 0, 0402; Manufacturer: Vishay-Dale; Power_W: 63mW; TempCo: 200 ppm/C; Value_Code: 1M50; Value: 1.5Meg; EIA_Code: E24; SizeX_mm: 1; SizeY_mm: 0.5; SizeZ_mm: 0.6; Value2: 0.063W; AEC Qualified: Y; VDC_V: 50V; AEC Category: Q200; AEC Grade: 0; ComponentLink1URL: http://www.vishay.com/docs/20035/dcrcwe3.pdf; Supplier Part Number 2: 71-CRCW04021M50JNED; Supplier 2: Mouser; RoHS: E; Value1: 5%; MountType: SMT; Supplier 1: Digi-Key; PackageReference: 0402; Tolerance_%: 5%; Res_ohm: 1.5M; SizeArea_mm2: 0.5; CompType: Resistor; PartNumber: CRCW04021M50JNED; ComponentLink1Description: Datasheet link; Supplier Part Number 1: 541-1.5MJCT-ND; Technology: Thick Film
R149 R157 = CMP-0025813-4: RES, 470, 5%, 0.1 W, AEC-Q200 Grade 0, 0603; Manufacturer: Vishay-Dale; Power_W: 100mW; TempCo: 200 ppm/C; Value_Code: 470R; Value: 470; EIA_Code: E24; SizeX_mm: 1.6; SizeY_mm: 0.8; SizeZ_mm: 1; Value2: 0.1W; SizeArea_mm2: 1.28; AEC Qualified: Y; VDC_V: 75V; AEC Category: Q200; AEC Grade: 0; Supplier Part Number 2: 59M6817; Supplier 2: Newark; Supplier Part Number 3: 71-CRCW0603J-470-E3; Supplier 3: Mouser; RoHS: E; Value1: 5%; MountType: SMT; Supplier 1: Digi-Key; PackageReference: 0603; Tolerance_%: 5%; Res_ohm: 470; CompType: Resistor; PartNumber: CRCW0603470RJNEA; ComponentLink1Description: Datasheet link; Supplier Part Number 1: 541-470GCT-ND; Technology: Thick Film; ComponentLink1URL: http://www.vishay.com/docs/20035/dcrcwe3.pdf
R150 R159 = CMP-0026237-2: RES, 2.49 k, 1%, 0.063 W, AEC-Q200 Grade 0, 0402; Manufacturer: Vishay-Dale; Power_W: 63mW; TempCo: 100 ppm/C; Value_Code: 2k49; Value: 2.49k; EIA_Code: E96; SizeX_mm: 1; SizeY_mm: 0.5; SizeZ_mm: 0.6; Value2: 0.063W; AEC Qualified: Y; VDC_V: 50V; AEC Category: Q200; AEC Grade: 0; ComponentLink1URL: http://www.vishay.com/docs/20035/dcrcwe3.pdf; Supplier Part Number 2: 52K6803; Supplier 2: Newark; Supplier Part Number 3: 71-CRCW0402-2.49K-E3; Supplier 3: Mouser; RoHS: E; Value1: 1%; MountType: SMT; Supplier 1: Digi-Key; PackageReference: 0402; Tolerance_%: 1%; Res_ohm: 2.49k; SizeArea_mm2: 0.5; CompType: Resistor; PartNumber: CRCW04022K49FKED; ComponentLink1Description: Datasheet link; Supplier Part Number 1: 541-2.49KLCT-ND; Technology: Thick Film
R?#1 R?#2 = 561020132009: WRIS-KWKB Thick Film Resistors, size 0612, 100Ohm, +/-5%, 0.75W; Rated Current: 86.6mA; Temperature Coefficient of Resistance: +/-200ppm/degC; Technical Reference: KB06121000J304DAATP0000; ComponentLink1Description: Manufacturer; ComponentLink1URL: http://www.we-online.de; ComponentLink2Description: Datasheet; ComponentLink2URL: https://katalog.we-online.com/pbs/datasheet/561020132009.pdf; Publisher: Wurth Elektronik; Rated Power: 0.75W; Resistance: 100Ohm; Mounting Technology: SMT; Height: 0.55mm; Part Number: 561020132009; Packaging: Tape and Reel; Published Date: September 2019; Size: 0612; Length: 1.6mm; Operating Temperature: -55 to +155degC; Resistance Tolerance: +/-5%; Width: 3.2mm
R?#5-R?#8 = CMP-009-00006-4: Chip Resistor, 0 Ohm, 0.1 W, -55 to 155 degC, 0603 (1608 Metric); Power: 100mW; Voltage Rating: 50V; Pins: 2; Mounting Technology: SM; Case/Package: 0603; Max Operating Temperature: 155°C; RoHS Compliant: True; Min Operating Temperature: -55°C; Tolerance: 5%
T?#1 T?#2 = 74930000: WE-STST Super Tiny Signal Transformer, size 4532, 350uH; Insulation Test Voltage: 1500VRMS; Turns Ratio: 1:1; ComponentLink1Description: Manufacturer; ComponentLink1URL: http://www.we-online.de; ComponentLink2Description: Datasheet; ComponentLink2URL: https://katalog.we-online.com/pbs/datasheet/74930000.pdf; Packaging: Tape and Reel; Publisher: Wurth Elektronik; Size: 4532; Inductance: 350uH; Mounting Technology: SMT; Operating Temperature: -40 to +105degC; Part Number: 74930000; Published Date: November 2019
U18 = CMP-0082059-1: 16 Kb I2C EEPROM Serial, SOIC-8; Manufacturer: ON Semiconductor; SizeArea_mm2: 29.351; SizeAreaWB_mm2: 55.131; SizeY_mm: 4.9; SizeZ_mm: 1.75; SizeX_mm: 5.99; PartNumber: CAT24C16WI-GT3; Supplier Part Number 2: 23AC2979; Supplier 3: Mouser; PackageReference: SOIC-8; Supplier Part Number 1: CAT24C16WI-GT3CT-ND; ComponentLink1Description: Datasheet URL; MountType: SMT; ComponentLink1URL: https://www.onsemi.com/pub/Collateral/CAT24C01-D.PDF; Supplier 1: Digi-Key; RoHS: Y; Supplier 2: Newark; Supplier Part Number 3: 698-CAT24C16WI-GT3
U19 U21 = CMP-0076010-3: Robust, Low Power 10/100 Ethernet Physical Layer Transceiver, RHB0032B (VQFN-32); Alternate PartNumber: DP83822IRHBT; Manufacturer: Texas Instruments; SizeZ_mm: 1.0; SizeX_mm: 5.0; SizeArea_mm2: 25.0; CompType: IC; SizeAreaWB_mm2: 49.0; AEC Category: Q200; AEC Qualified: N; ComponentLink1URL: http://www.ti.com/lit/ds/symlink/dp83822i.pdf; PackageDescription: VQFN-32; SizeY_mm: 5.0; PackageReference: RHB0032B; RoHS: Y; PartNumber: DP83822IRHBR; ComponentLink1Description: Datasheet Link; MountType: SMT; Alternate Manufacturer: Texas Instruments; ComponentLink2Description: ComponentLink2Description; ComponentLink2URL: http://www.ti.com/product/dp83822i
U20 = CMP-0051777-1: Dual Inverter Buffer/Driver with Open-Drain Output, DBV0006A, LARGE T&R; Manufacturer: Texas Instruments; Schmitt Trigger: No; Logic: Inverting; F @ Nom Voltage(Max)(Mhz): 150; VCC(Max)(V): 5.5; Rating: Catalog; Sub-Family: Inverting Buffer/Driver; Technology Family: LVC; VCC(Min)(V): 1.65; Voltage(Nom)(V): 1.8,2.5,3.3,5; Output Drive (IOL/IOH)(Max)(mA): 32/-32; Output Type: CMOS; ICC @ Nom Voltage(Max)(mA): 0.01; Bits(#): 2; tpd @ Nom Voltage(Max)(ns): 8.2,4.4,3.9,3.4; Input Type: CMOS/TTL; DatasheetVersion: SCES307I; Generic Part Number: SN74LVC2G06; 3-State Output: No; PackageReference: DBV0006A; Operating Temperature Range(C): -40 to 125,-40 to 85; PartId: 1; PartNumber: SN74LVC2G06DBVR